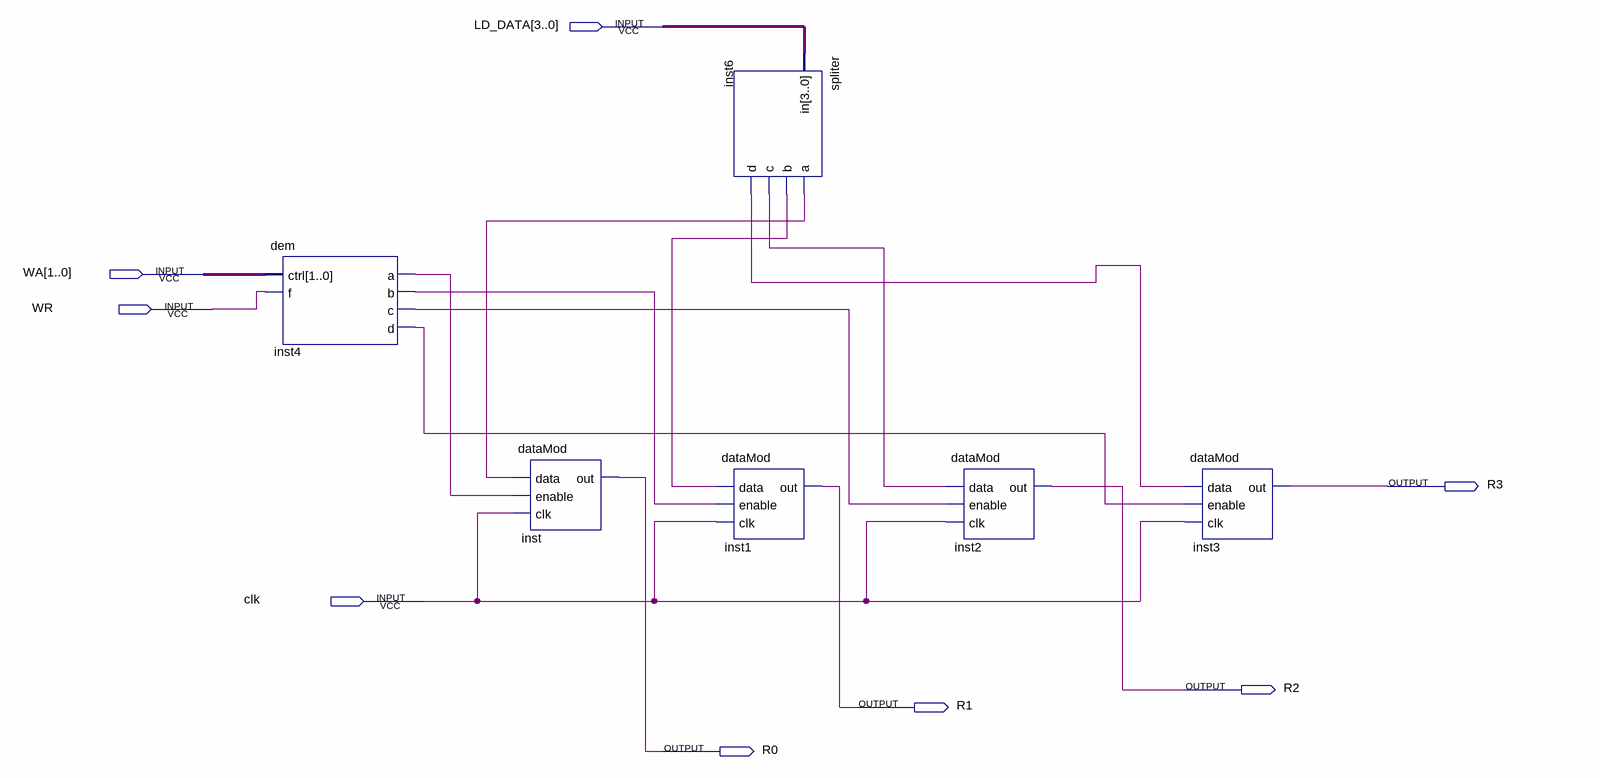
[diagram p0: schematic sheet]
// Quartus schematic reg.bdf as structural Verilog: 6 symbols, 8 pins
module \reg  (
  input  [3:0] LD_DATA,
  input  [1:0] WA,
  input  WR,
  input  clk,
  output R3,
  output R2,
  output R1,
  output R0
);

  wire inst4_a, inst4_b, inst4_c, inst4_d, inst6_a, inst6_b, inst6_c, inst6_d;

  dem inst4 (.ctrl(WA), .f(WR), .a(inst4_a), .b(inst4_b), .c(inst4_c), .d(inst4_d));
  dataMod inst (.data(inst6_a), .enable(inst4_a), .clk(clk), .out(R0));
  spliter inst6 (.in(LD_DATA), .a(inst6_a), .b(inst6_b), .c(inst6_c), .d(inst6_d));
  dataMod inst1 (.data(inst6_b), .enable(inst4_b), .clk(clk), .out(R1));
  dataMod inst2 (.data(inst6_c), .enable(inst4_c), .clk(clk), .out(R2));
  dataMod inst3 (.data(inst6_d), .enable(inst4_d), .clk(clk), .out(R3));
endmodule
